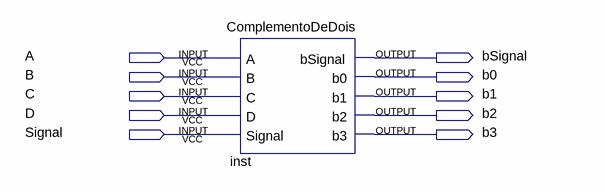
[diagram p0: schematic sheet]
// Quartus schematic CompDeDois.bdf as structural Verilog: 1 symbols, 10 pins
module CompDeDois (
  input  A,
  input  B,
  input  C,
  input  D,
  input  Signal,
  output bSignal,
  output b0,
  output b1,
  output b2,
  output b3
);

  ComplementoDeDois inst (
    .A(A), .B(B), .C(C), .D(D), .Signal(Signal), .bSignal(bSignal), .b0(b0), .b1(b1), .b2(b2), .b3(b3));
endmodule
